# EAGLE design ATX_Power_Supply (EAGLE 7.3.0)
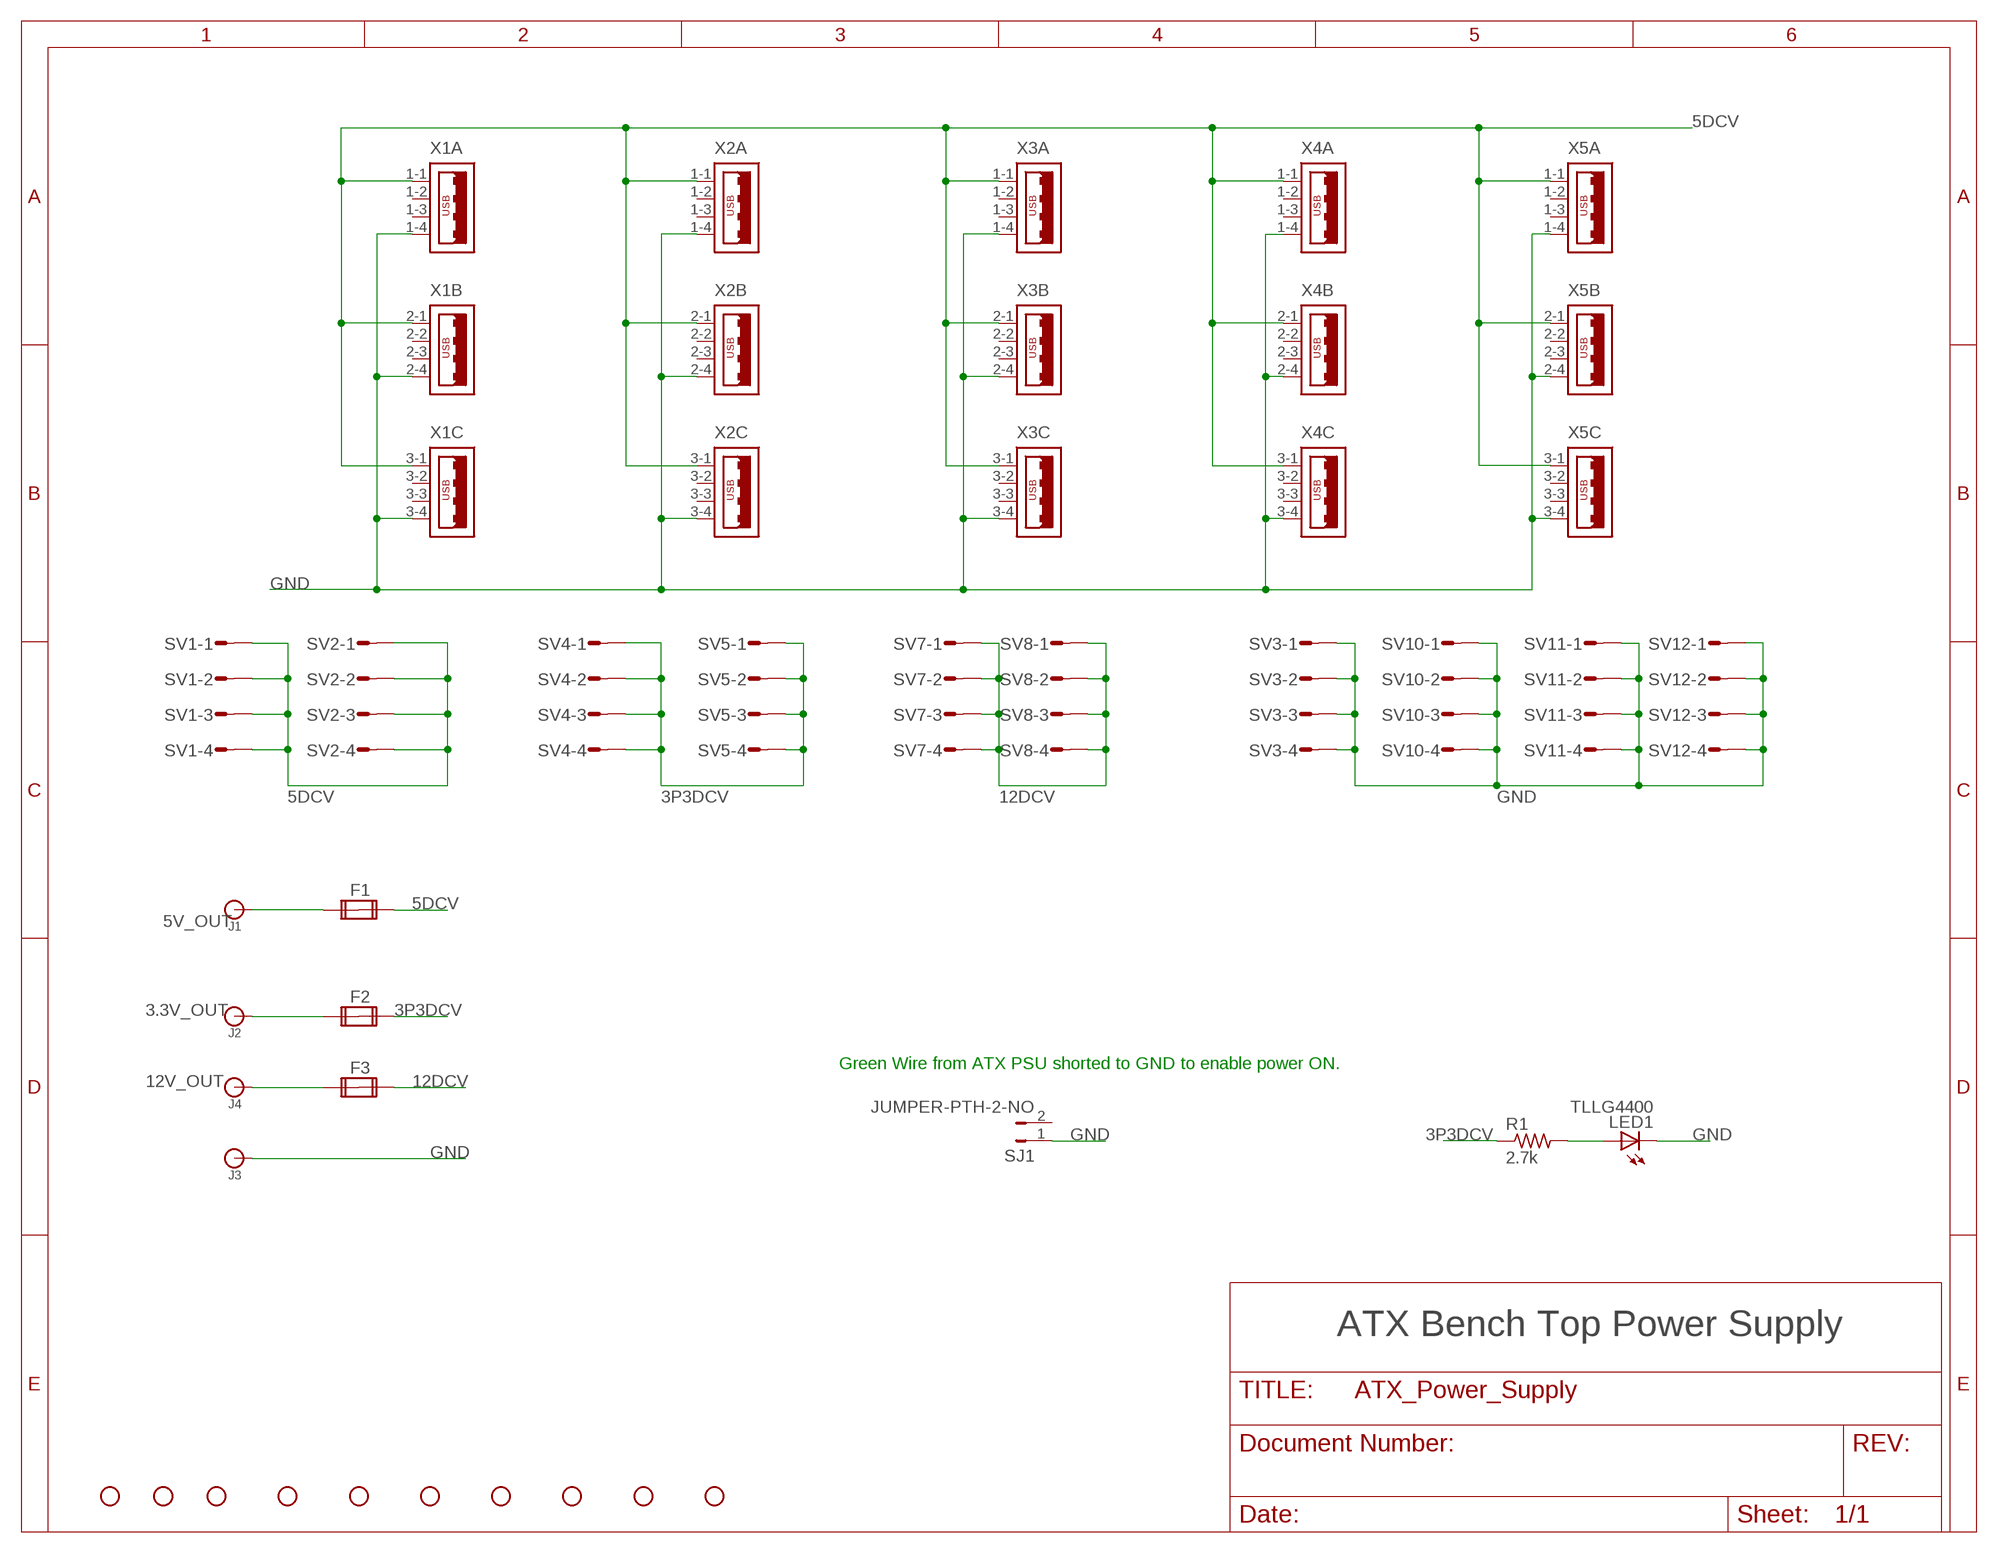
[diagram p0: schematic, sheet 1]

## Parts
F1  FUSE2P  [FUSE1]
F2  FUSE2P  [FUSE1]
F3  FUSE2P  [FUSE1]
J1  BANANA_CONN  [BANANA_CONN]
J2  BANANA_CONN  [BANANA_CONN]
J3  BANANA_CONN  [BANANA_CONN]
J4  BANANA_CONN  [BANANA_CONN]
LED1  TLLG4400  [LED3MM]
R1  2.7k  R-US_0204/5  [0204/5]
SJ1  JUMPER-PTH-2-NO  [PTH-JUMPER-2-NO_NO_SILK]
STANDOFF1  STAND-OFF  [STAND-OFF]
STANDOFF2  STAND-OFF  [STAND-OFF]
STANDOFF3  STAND-OFF  [STAND-OFF]
STANDOFF4  STAND-OFF  [STAND-OFF]
STANDOFF5  STAND-OFF  [STAND-OFF]
STANDOFF6  STAND-OFF  [STAND-OFF]
STANDOFF7  STAND-OFF  [STAND-OFF]
STANDOFF8  STAND-OFF  [STAND-OFF]
STANDOFF9  STAND-OFF  [STAND-OFF]
STANDOFF10  STAND-OFF  [STAND-OFF]
SV1  MT6-4  [MT6-4]
SV2  MT6-4  [MT6-4]
SV3  MT6-4  [MT6-4]
SV4  MT6-4  [MT6-4]
SV5  MT6-4  [MT6-4]
SV7  MT6-4  [MT6-4]
SV8  MT6-4  [MT6-4]
SV10  MT6-4  [MT6-4]
SV11  MT6-4  [MT6-4]
SV12  MT6-4  [MT6-4]
X1  USB_3PSHIELD-85-32003-00X-1  [85-32003-00X-1]
X2  USB_3PSHIELD-85-32003-00X-1  [85-32003-00X-1]
X3  USB_3PSHIELD-85-32003-00X-1  [85-32003-00X-1]
X4  USB_3PSHIELD-85-32003-00X-1  [85-32003-00X-1]
X5  USB_3PSHIELD-85-32003-00X-1  [85-32003-00X-1]

## Nets
3.3V_OUT: F2.1A J2.P$1
3P3DCV: F2.2A R1.1 SV4.1 SV4.2 SV4.3 SV4.4 SV5.1 SV5.2 SV5.3 SV5.4
5DCV: F1.2A SV1.1 SV1.2 SV1.3 SV1.4 SV2.1 SV2.2 SV2.3 SV2.4 X1.1-1 X1.2-1 X1.3-1 X2.1-1 X2.2-1 X2.3-1 X3.1-1 X3.2-1 X3.3-1 X4.1-1 X4.2-1 X4.3-1 X5.1-1 X5.2-1 X5.3-1
5V_OUT: F1.1A J1.P$1
12DCV: F3.2A SV7.1 SV7.2 SV7.3 SV7.4 SV8.1 SV8.2 SV8.3 SV8.4
12V_OUT: F3.1A J4.P$1
GND: J3.P$1 LED1.K(C) SJ1.1 SV3.1 SV3.2 SV3.3 SV3.4 SV10.1 SV10.2 SV10.3 SV10.4 SV11.1 SV11.2 SV11.3 SV11.4 SV12.1 SV12.2 SV12.3 SV12.4 X1.1-4 X1.2-4 X1.3-4 X2.1-4 X2.2-4 X2.3-4 X3.1-4 X3.2-4 X3.3-4 X4.1-4 X4.2-4 X4.3-4 X5.1-4 X5.2-4 X5.3-4
N$5: LED1.A R1.2
Unconnected: F1.1B F1.2B F2.1B F2.2B F3.1B F3.2B SJ1.2 X1.1-2 X1.1-3 X1.2-2 X1.2-3 X1.3-2 X1.3-3 X1.M1(S:S1) X1.M2(S:S2) X1.M3(S:S3) X1.M4(S:S4) X2.1-2 X2.1-3 X2.2-2 X2.2-3 X2.3-2 X2.3-3 X2.M1(S:S1) X2.M2(S:S2) X2.M3(S:S3) X2.M4(S:S4) X3.1-2 X3.1-3 X3.2-2 X3.2-3 X3.3-2 X3.3-3 X3.M1(S:S1) X3.M2(S:S2) X3.M3(S:S3) X3.M4(S:S4) X4.1-2 X4.1-3 X4.2-2 X4.2-3 X4.3-2 X4.3-3 X4.M1(S:S1) X4.M2(S:S2) X4.M3(S:S3) X4.M4(S:S4) X5.1-2 X5.1-3 X5.2-2 X5.2-3 X5.3-2 X5.3-3 X5.M1(S:S1) X5.M2(S:S2) X5.M3(S:S3) X5.M4(S:S4)

## Notes on the sheet
- Green Wire from ATX PSU shorted to GND to enable power ON.
- ATX Bench Top Power Supply

## Library data of the parts
F1-F3 = special:FUSE2P: FUSE 5 x 20 mm
J1-J4 = SparkFun-Connectors:BANANA_CONN: Through-hole banana jack
LED1 = led:TLLG4400: Low Current (2mA) LED 3 mm Tinted Diffused Package color GREEN Source: Data sheet <http://www.farnell.com/datasheets/391098.pdf>; MF: VISHAY SEMICONDUCTOR; OC_FARNELL: 1612435
R1 = resistor:R-US_: RESISTOR, American symbol
SJ1 = SparkFun-Passives:JUMPER-PTH-2-NO
STANDOFF1-STANDOFF10 = SparkFun-Electromechanical:STAND-OFF: #4 Stand Off This is the mechanical footprint for a #4 phillips button head screw. Use the keepout ring to avoid running the screw head into surrounding components. SKU : PRT-00447
SV1-SV5 SV7 SV8 SV10-SV12 = con-amp-mt:MT6-4: AMP MT6 CONNECTOR; OC_FARNELL: unknown; OC_NEWARK: unknown
X1-X5 = con-cypressindustries:USB_3PSHIELD-: Triple USB Connector Source: www.cypressindustries.com; OC_FARNELL: unknown; OC_NEWARK: unknown

## Board
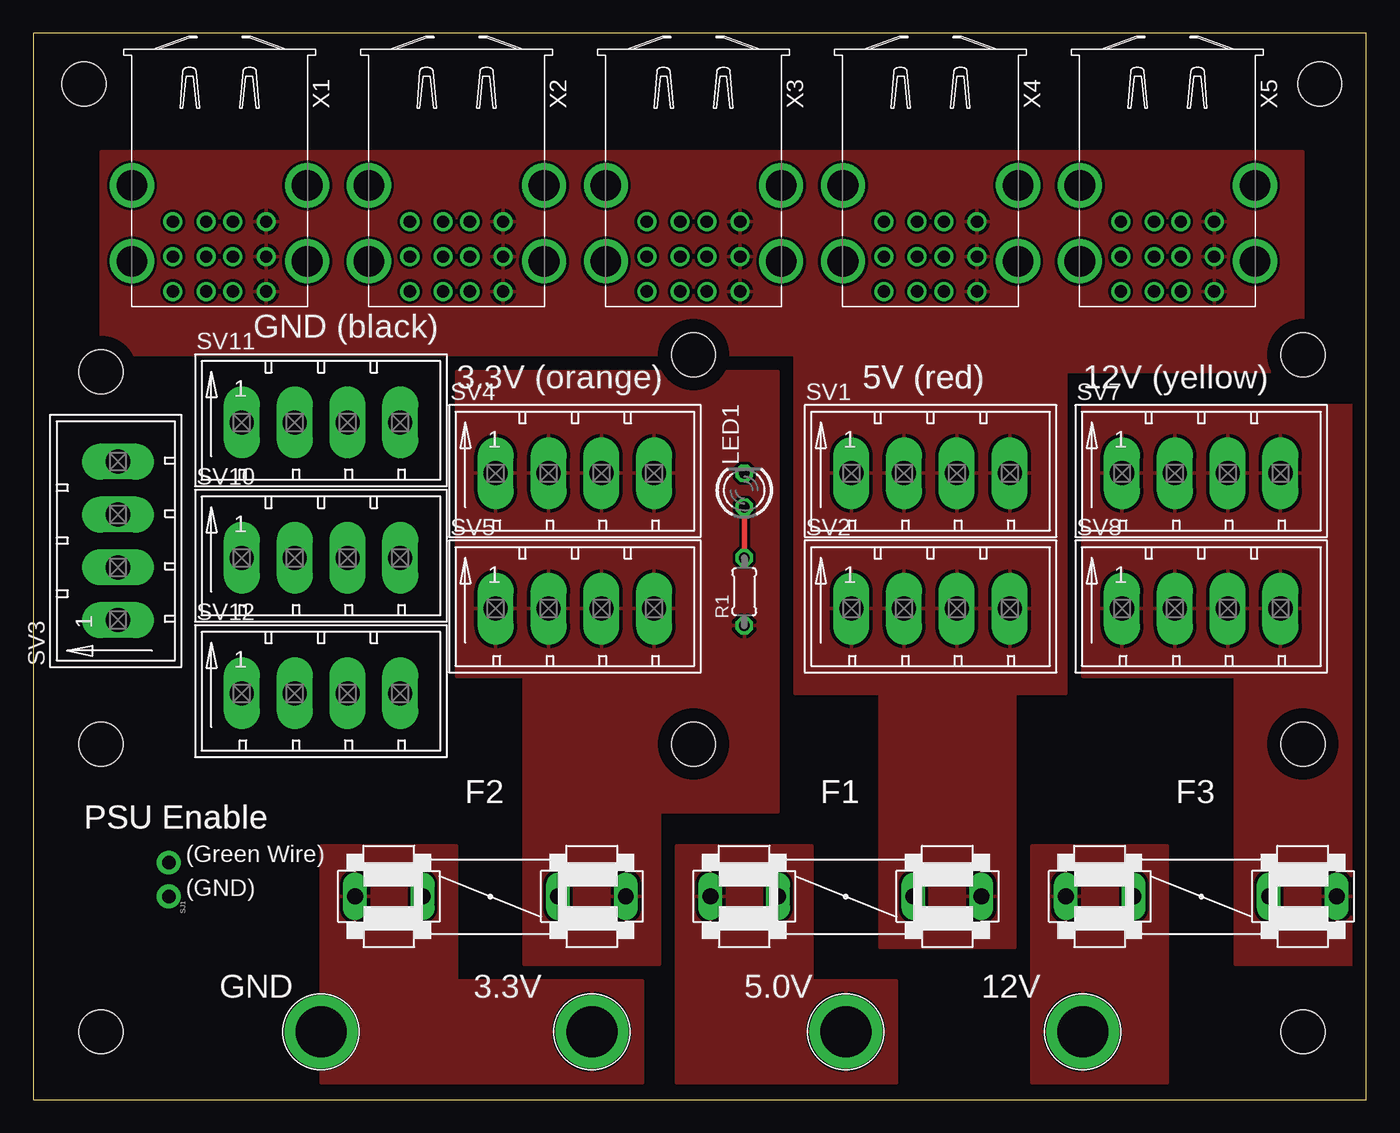
[diagram p1: board, top side]
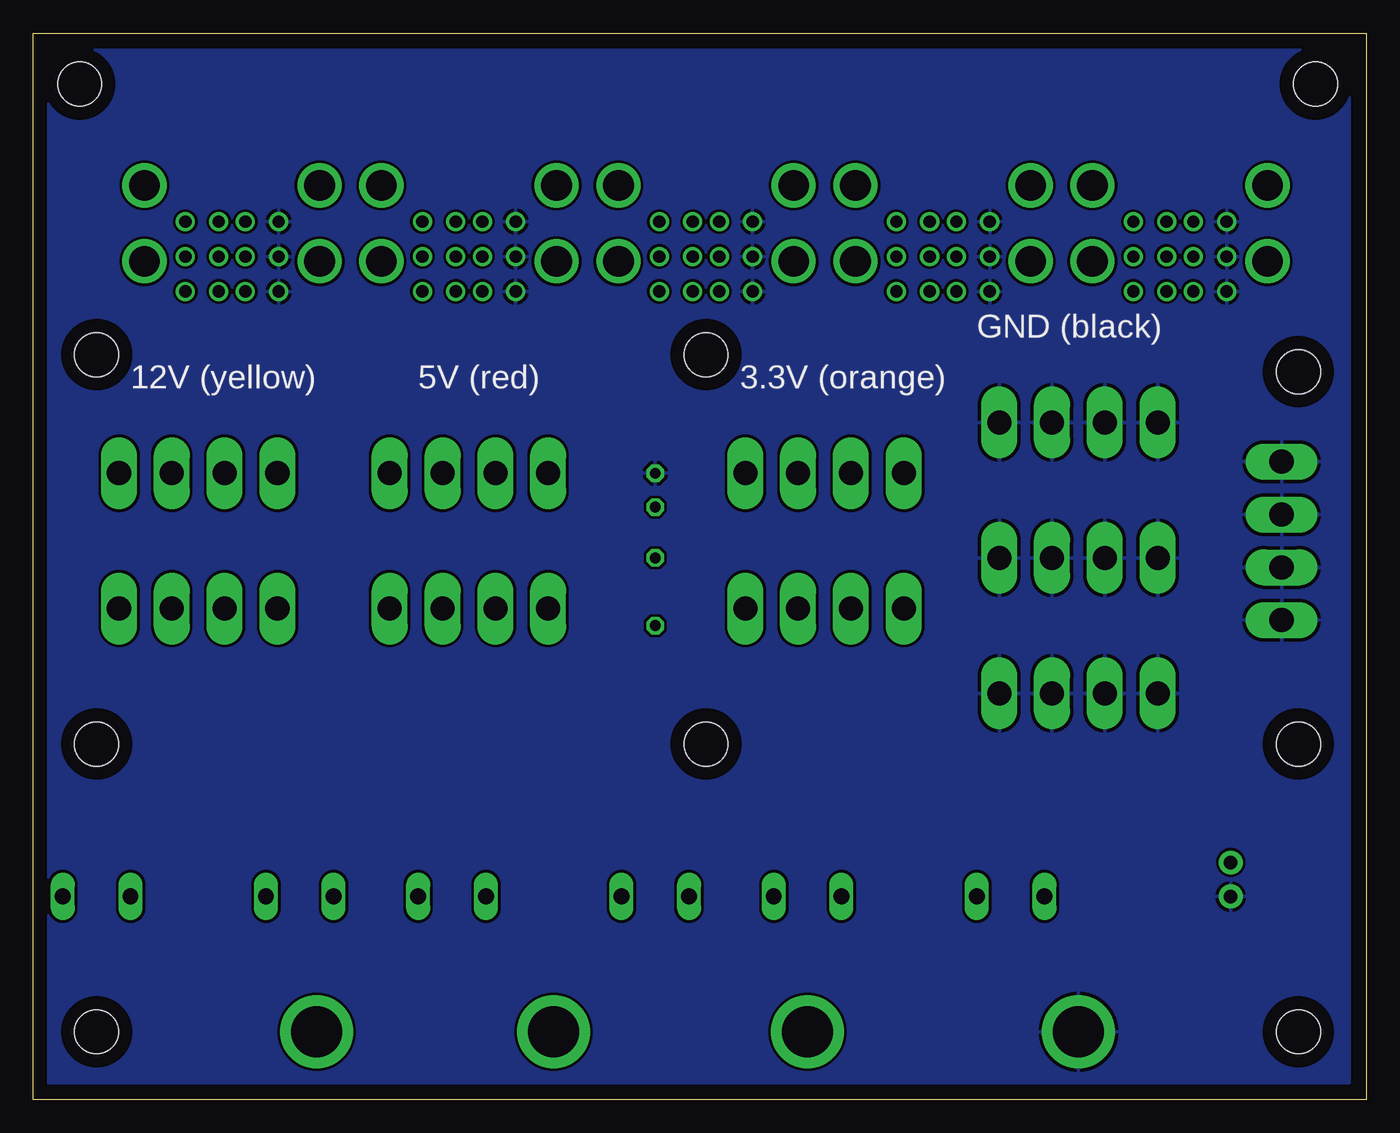
[diagram p2: board, bottom side, seen from below]

Size 100 x 80 mm. Coordinates in mm from the lower left corner, seen from the top.
Outline: 0,0 100,0 100,80 0,80 0,0
Copper layers (1*16): Top 0.035mm / dielectric 1.5mm / Bottom 0.035mm
Design rules "default": minimum track width 10mil, minimum drill 24mil, track to track 8mil, track to pad 8mil, pad to pad 8mil, via to via 8mil, smd to smd 8mil, copper to edge 40mil, drill to drill 8mil, minimum pad ring 10mil, minimum via ring 8mil, stop-mask expansion 4mil, vias tented up to drill 0mil, thermal gap 10mil

### Footprints (pad centres in the part's own frame; a part is rotated, then mirrored left to right if it is on the bottom)
FUSE1 = drill 1.194 long: 1A -10.16,0; 1B -5.08,0; 2A 10.16,0; 2B 5.08,0
BANANA_CONN = drill 3.81 pad 5.461: P$1 0,0
LED3MM = drill 0.813 octagon: A -1.27,0; K 1.27,0
0204/5 = drill 0.813 octagon: 1 -2.54,0; 2 2.54,0
PTH-JUMPER-2-NO_NO_SILK = drill 1.016 pad 1.778: 1 -1.27,0; 2 1.27,0
STAND-OFF = hole 3.302: 0,0
MT6-4 = drill 1.803 long: 1 -5.944,0; 2 -1.981,0; 3 1.981,0; 4 5.944,0
85-32003-00X-1 = drill 0.92 pad 1.27: 1-1 2.71,3.5; 1-2 2.71,1; 1-3 2.71,-1; 1-4 2.71,-3.5; 2-1 5.33,3.5; 2-2 5.33,1; 2-3 5.33,-1; 2-4 5.33,-3.5; 3-1 7.95,3.5; 3-2 7.95,1; 3-3 7.95,-1; 3-4 7.95,-3.5 | drill 2.3 pad 3: M1 0,6.57; M2 0,-6.57; M3 5.68,6.57; M4 5.68,-6.57

### Placement (x,y rotation side)
F1  60.96,15.24 0 top
F2  34.29,15.24 0 top
F3  87.63,15.24 0 top
J1  60.96,5.08 0 top
J2  41.91,5.08 0 top
J3  21.59,5.08 0 top
J4  78.74,5.08 0 top
LED1  53.34,45.72 90 top
R1  53.34,38.1 90 top
SJ1  10.16,16.51 90 top
STANDOFF1  5.08,5.08 0 top
STANDOFF2  95.25,5.08 0 top
STANDOFF3  3.81,76.2 0 top
STANDOFF4  96.52,76.2 0 top
STANDOFF5  5.08,54.61 0 top
STANDOFF6  95.25,55.88 0 top
STANDOFF7  5.08,26.67 0 top
STANDOFF8  95.25,26.67 0 top
STANDOFF9  49.53,55.88 0 top
STANDOFF10  49.53,26.67 0 top
SV1  67.31,46.99 0 top
SV2  67.31,36.83 0 top
SV3  6.35,41.91 90 top
SV4  40.64,46.99 0 top
SV5  40.64,36.83 0 top
SV7  87.63,46.99 0 top
SV8  87.63,36.83 0 top
SV10  21.59,40.64 0 top
SV11  21.59,50.8 0 top
SV12  21.59,30.48 0 top
X1  13.97,68.58 270 top
X2  31.75,68.58 270 top
X3  49.53,68.58 270 top
X4  67.31,68.58 270 top
X5  85.09,68.58 270 top

### Tracks (layer width: path | path; a pad name or v marks a point on that pad's centre or on a via)
3.3V_OUT
  pour Top: 21.59,19.05 31.75,19.05 31.75,8.89 45.72,8.89 45.72,7.62 45.72,1.27 21.59,1.27
3P3DCV
  pour Top: 31.75,54.61 55.88,54.61 55.88,21.59 46.99,21.59 46.99,10.16 36.83,10.16 36.83,31.75 31.75,31.75
5DCV
  pour Top: 5.08,71.12 5.08,55.88 57.15,55.88 57.15,54.61 57.15,30.48 77.47,30.48 77.47,54.61 95.25,54.61 95.25,71.12
  pour Top: 63.5,30.48 63.5,11.43 73.66,11.43 73.66,31.75 63.5,31.75
5V_OUT
  pour Top: 48.26,19.05 58.42,19.05 58.42,8.89 64.77,8.89 64.77,1.27 48.26,1.27
12DCV
  pour Top: 80.01,52.07 99.06,52.07 99.06,10.16 90.17,10.16 90.17,31.75 78.74,31.75 78.74,52.07
12V_OUT
  pour Top: 74.93,19.05 85.09,19.05 85.09,1.27 74.93,1.27
GND
  pour Bottom: 1.27,1.27 1.27,78.74 99.06,78.74 99.06,1.27
N$5
  Top 0.406: LED1.A R1.2

### Text on the board
tPlace: GND (black) | 3.3V (orange) | 5V (red) | 5V (red) | 12V (yellow) | PSU Enable | PSU Enable | (Green Wire) | (GND) | GND | 3.3V | 5.0V | 12V
bPlace: GND (black) | 3.3V (orange) | 5V (red) | 12V (yellow)